# Altium schematic sheet HCPL-3120 Gate Driver Circuit.SchDoc
size A0; SheetNumber: 1; SheetTotal: 1
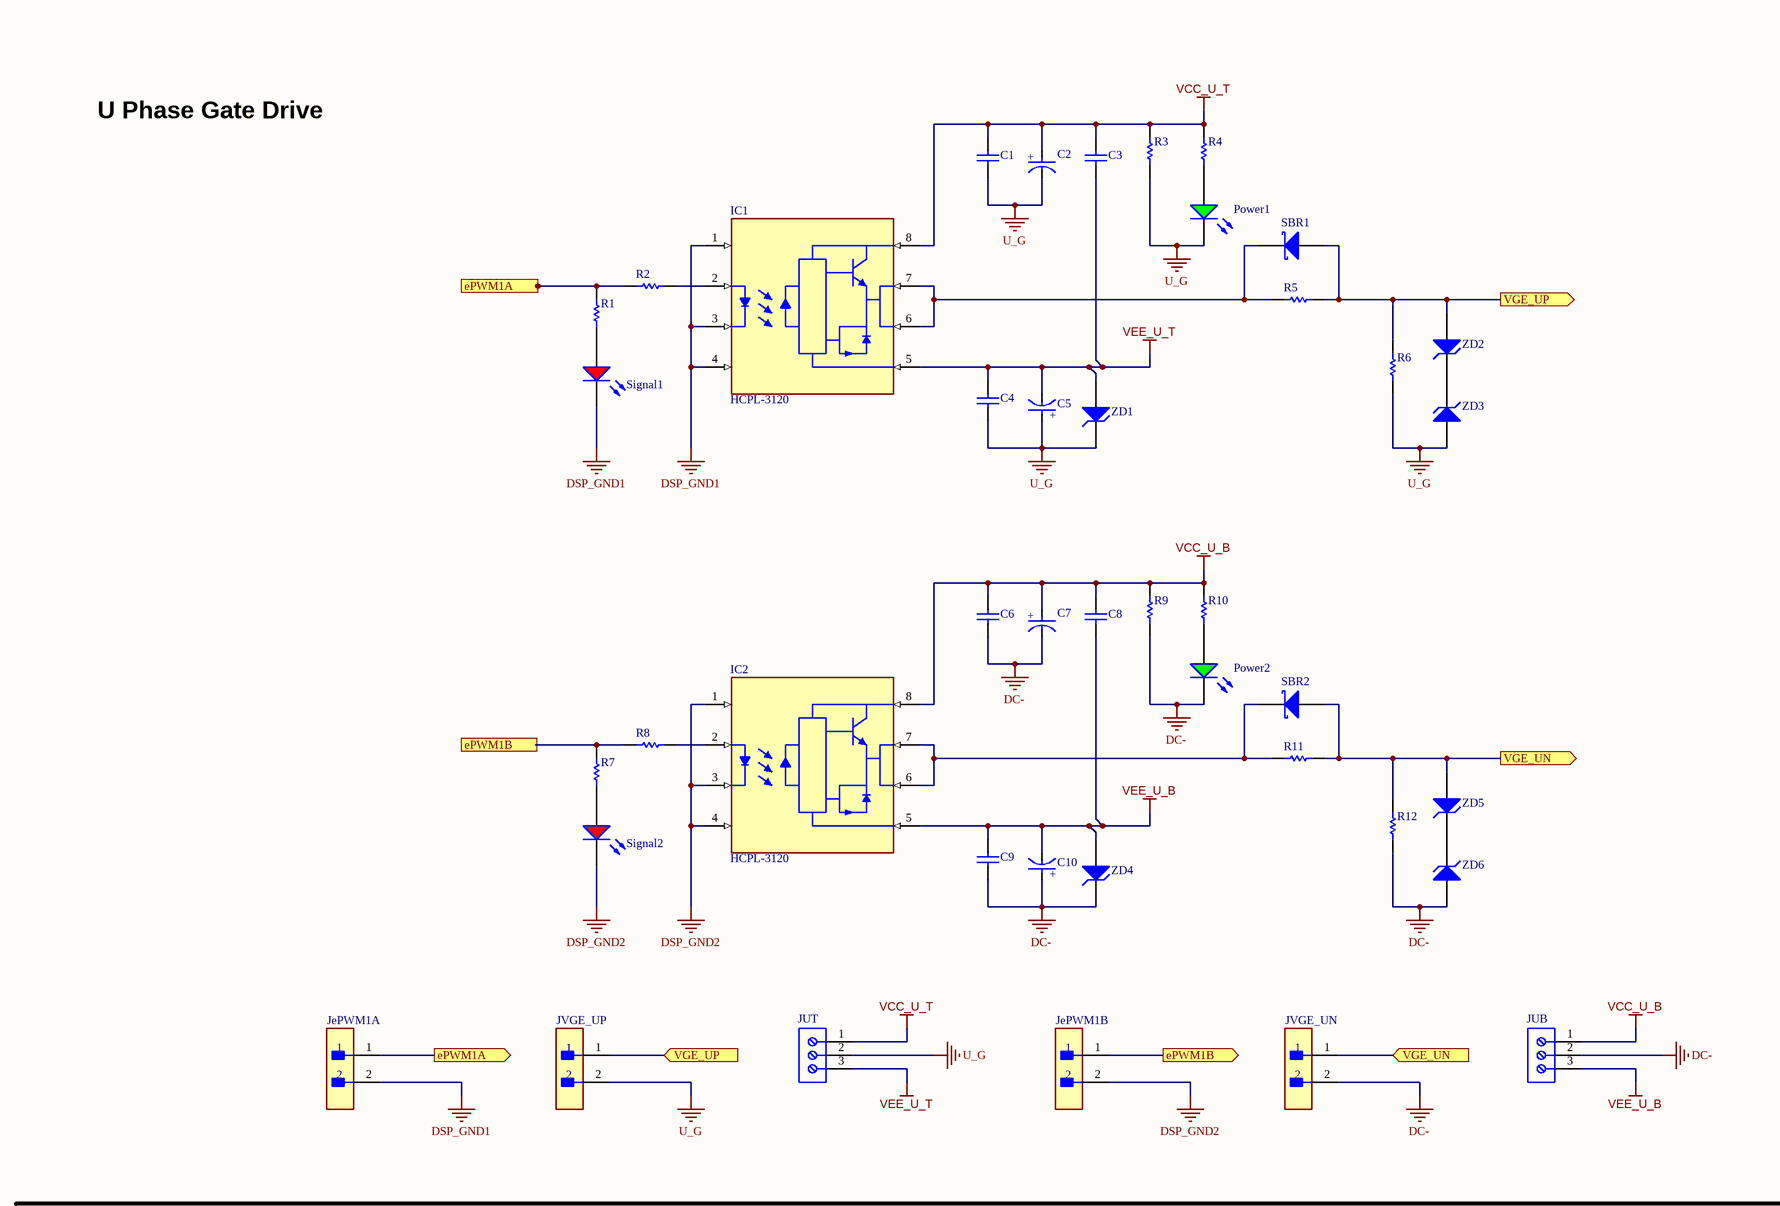
[diagram p0: HCPL-3120 Gate Driver Circuit.SchDoc, left]

## Parts
C1  GRM188R71H104KA93D  [CAPC1608X90X35ML10T15]  (value not drawn)
C2  EEUTA1H101  [FP-RAD-TH-D_10_0_5-L_12_5-MFG]  (value not drawn)
C3  GRM188R71H104KA93D  [CAPC1608X90X35ML10T15]  (value not drawn)
C4  GRM188R71H104KA93D  [CAPC1608X90X35ML10T15]  (value not drawn)
C5  EEUTA1H101  [FP-RAD-TH-D_10_0_5-L_12_5-MFG]  (value not drawn)
C6  GRM188R71H104KA93D  [CAPC1608X90X35ML10T15]  (value not drawn)
C7  EEUTA1H101  [FP-RAD-TH-D_10_0_5-L_12_5-MFG]  (value not drawn)
C8  GRM188R71H104KA93D  [CAPC1608X90X35ML10T15]  (value not drawn)
C9  GRM188R71H104KA93D  [CAPC1608X90X35ML10T15]  (value not drawn)
C10  EEUTA1H101  [FP-RAD-TH-D_10_0_5-L_12_5-MFG]  (value not drawn)
IC1  HCPL-3120  [FP-DIP-8-MFG]
IC2  HCPL-3120  [FP-DIP-8-MFG]
JePWM1A  TSW-102-07-L-S  [FP-TSW-102-07-L-S-MFG]  (value not drawn)
JePWM1B  TSW-102-07-L-S  [FP-TSW-102-07-L-S-MFG]  (value not drawn)
JUB  691214110003  [691214110003]  (value not drawn)
JUT  691214110003  [691214110003]  (value not drawn)
JVGE_UN  TSW-102-07-L-S  [FP-TSW-102-07-L-S-MFG]  (value not drawn)
JVGE_UP  TSW-102-07-L-S  [FP-TSW-102-07-L-S-MFG]  (value not drawn)
Power1  151031VS04000  [WL-TMRC_D3.95H5.3]  (value not drawn)
Power2  151031VS04000  [WL-TMRC_D3.95H5.3]  (value not drawn)
R1  ERJ-8ENF1001V  [RESC3216X70X50LL05T20]  (value not drawn)
R2  ERJ8ENF3300V  [RESC3216X70X50LL05T20]  (value not drawn)
R3  ERJ-8ENF1001V  [RESC3216X70X50LL05T20]  (value not drawn)
R4  ERJ-8ENF1001V  [RESC3216X70X50LL05T20]  (value not drawn)
R5  ERJ-8ENF30R0V  [RESC3216X70X50NL05T20]  (value not drawn)
R6  ERJ-8ENF1002V  [RESC3216X70X50LL05T20]  (value not drawn)
R7  ERJ-8ENF1001V  [RESC3216X70X50LL05T20]  (value not drawn)
R8  ERJ8ENF3300V  [RESC3216X70X50LL05T20]  (value not drawn)
R9  ERJ-8ENF1001V  [RESC3216X70X50LL05T20]  (value not drawn)
R10  ERJ-8ENF1001V  [RESC3216X70X50LL05T20]  (value not drawn)
R11  ERJ-8ENF30R0V  [RESC3216X70X50NL05T20]  (value not drawn)
R12  ERJ-8ENF1002V  [RESC3216X70X50LL05T20]  (value not drawn)
SBR1  DFLS130L-7  [DIOD-POWERDI123-2_A_V]  (value not drawn)
SBR2  DFLS130L-7  [DIOD-POWERDI123-2_A_V]  (value not drawn)
Signal1  151031SS04000  [WL-TMRC_D3.95H5.3]  (value not drawn)
Signal2  151031SS04000  [WL-TMRC_D3.95H5.3]  (value not drawn)
ZD1  MMSZ4688T1G  [ONSC-SOD-123-2-425-04_V]  (value not drawn)
ZD2  SZMMSZ4702T1G  [ONSC-SOD-123-2-425-04_V]  (value not drawn)
ZD3  SZMMSZ4702T1G  [ONSC-SOD-123-2-425-04_V]  (value not drawn)
ZD4  MMSZ4688T1G  [ONSC-SOD-123-2-425-04_V]  (value not drawn)
ZD5  SZMMSZ4702T1G  [ONSC-SOD-123-2-425-04_V]  (value not drawn)
ZD6  SZMMSZ4702T1G  [ONSC-SOD-123-2-425-04_V]  (value not drawn)

## Ports
ePWM1A (in, see HCPL-3120 Gate Driver Circuit[2B]), ePWM1A (out, see HCPL-3120 Gate Driver Circuit[2A]), ePWM1B (in, see HCPL-3120 Gate Driver Circuit[4B]), ePWM1B (out, see HCPL-3120 Gate Driver Circuit[2A]), VGE_UN (in, see HCPL-3120 Gate Driver Circuit[5A]), VGE_UN (out, see HCPL-3120 Gate Driver Circuit[4B]), VGE_UP (in, see HCPL-3120 Gate Driver Circuit[5A]), VGE_UP (out, see HCPL-3120 Gate Driver Circuit[2B])

## Nets
DC-: C6.2 C7.1(C) C9.2 C10.2(A) JUB.2 JVGE_UN.2 Power2.2(K) R9.2 R12.2 ZD4.1(K) ZD6.2(A)
DSP_GND1: IC1.1(N/C) IC1.3(CATHODE) IC1.4(N/C) JePWM1A.2 Signal1.2(K)
DSP_GND2: IC2.1(N/C) IC2.3(CATHODE) IC2.4(N/C) JePWM1B.2 Signal2.2(K)
U_G: C1.2 C2.1(C) C4.2 C5.2(A) JUT.2 JVGE_UP.2 Power1.2(K) R3.2 R6.2 ZD1.1(K) ZD3.2(A)
VCC_U_B: C6.1 C7.2(A) C8.1 IC2.8(VCC) JUB.1 R9.1 R10.1
VCC_U_T: C1.1 C2.2(A) C3.1 IC1.8(VCC) JUT.1 R3.1 R4.1
VEE_U_B: C8.2 C9.1 C10.1(C) IC2.5(VEE) JUB.3 ZD4.2(A)
VEE_U_T: C3.2 C4.1 C5.1(C) IC1.5(VEE) JUT.3 ZD1.2(A)
ePWM1A: JePWM1A.1 R1.1 R2.1 ; port ePWM1A
ePWM1B: JePWM1B.1 R7.1 R8.1 ; port ePWM1B
VGE_UN: JVGE_UN.1 R11.2 R12.1 SBR2.1(A) ZD5.2(A) ; port VGE_UN
VGE_UP: JVGE_UP.1 R5.2 R6.1 SBR1.1(A) ZD2.2(A) ; port VGE_UP
NetIC1_2: IC1.2(ANODE) R2.2
NetIC1_6: IC1.6(VO) IC1.7(VO) R5.1 SBR1.2(K)
NetIC2_2: IC2.2(ANODE) R8.2
NetIC2_6: IC2.6(VO) IC2.7(VO) R11.1 SBR2.2(K)
NetPower1_1: Power1.1(A) R4.2
NetPower2_1: Power2.1(A) R10.2
NetR1_2: R1.2 Signal1.1(A)
NetR7_2: R7.2 Signal2.1(A)
NetZD2_1: ZD2.1(K) ZD3.1(K)
NetZD5_1: ZD5.1(K) ZD6.1(K)

## Notes on the sheet
- U Phase Gate Drive
- (in symbol CMP-05427-000114-1) +

## Library data of the parts
C1 C3 C4 C6 C8 C9 = CMP-2100-03643-1: Chip Capacitor, 0.1 uF, +/- 10%, 50 V, -55 to 125 degC, 0603 (1608 Metric), RoHS, Tape and Reel; Manufacturer: Murata; Dielectric Material: Ceramic; Voltage Rating: 50V; Capacitance: 100nF; Dielectric: X7R; Insulation Resistance: 10GR; Case Code (Metric): 1608; Lead Free: LeadFree; Depth: 0.8mm; Number of Pins: 2; Radiation Hardening: No; Case/Package: 0603; Manufacturer URL: http://www.murata.com/; Packaging: TapeandReel; Length: 1.6mm; Contact Plating: Tin; Datasheet URL: http://psearch.en.murata.com/capacitor/product/GRM188R71H104KA93%23.pdf; Tolerance: 10%; Case Code (Imperial): 0603; Min Operating Temperature: -55degC; RoHSCompliant: true; Voltage: 50V; Termination: SMD/SMT; Mount: SurfaceMount; Material: Ceramic; Package Quantity: 1; Height: 0.8mm; Thickness: 0.035inch; REACH SVHC: NoSVHC; Max Operating Temperature: 125degC; Width: 0.8mm; Package Reference: 0603; Voltage Rating (DC): 50V; Datasheet Version: 42675.0; Package Description: 2-Pin Surface Mount Device, Body 1.6 x 0.8 mm
C2 C5 C7 C10 = CMP-05427-000114-1: Aluminum Electrolytic Capacitors (Radial Lead Type) AEC-Q200 Qualified 100uF ±20% 50V; ESR (Equivalent Series Resistance): 180mR; Lead Diameter: 0.6mm; Life (Hours): 2000Hour; Ripple Current: 555mA; Series: TA; Package Quantity: 200; Length: 12.5mm; Lead Pitch: 5mm; REACH SVHC: No SVHC; RoHS Compliant: Yes; Height: 12.5mm; Contact Plating: Tin; Capacitance: 100uF; Height - Seated (Max): 0.531inch; Min Operating Temperature: -40°C; Voltage Rating (DC): 50V; Voltage Rating: 50V; Case/Package: Radial; Radiation Hardening: No; Tolerance: 20%; Impedance: 180mR; Diameter: 10mm; Packaging: Bulk; Max Operating Temperature: 125°C; Termination: Radial; Mount: Through Hole
IC1 IC2 = HCPL-3120: Optocoupler Drive Push-Pull 1-CH 30V 1500V 8-Pin PDIP Tube
JePWM1A JePWM1B JVGE_UN JVGE_UP = CMP-02766-001428-1: CONN HEADER VERT 2POS 2.54MM; Voltage Rating: 550V; Current Rating: 7.6A; Gender: Male; Number of Contacts: 2; Connector Type: Male Pin; Radiation Hardening: No; Orientation: Straight; Contact Plating: Gold; Max Operating Temperature: 125°C; Mount: Through Hole; Package Quantity: 1; Number of Rows: 1; Housing Material: Polyester; RoHS Compliant: Yes; Length: 5.08mm; Max Voltage Rating (AC): 550V; Pitch: 2.54mm; Packaging: Bulk; Depth: 2.54mm; Termination: Solder; Min Operating Temperature: -55°C; Housing Color: Black; Lead Free: Lead Free; Color: Black; Number of Positions: 2; Width: 2.54mm; Max Current Rating: 7.6A; REACH SVHC: No SVHC; Contact Material: Bronze; Contact Mating Length: 0.23inch; Series: TSW; Contact Type: Male Pin
JUB JUT = CMP-1502-02466-2: NexarPartId: 18818289; Number of Levels: 1; Voltage: 300V; Pitch: 3.5052mm; Stripping Length: -6mm; Number of Positions Per Level: 3; Plating: Brass, Steel; Wire/Cable Gauge: 24AWG; Wire Gauge (Min): 16AWG; Current Rating: 10A; Width: 10.9mm; Length: 7.4mm; Housing Material: Nylon; Height: 12.2mm; Min Operating Temperature: -40°C; Contact Plating: Brass, Tin; Packaging: Box; Color: Blue, Green; Number of Contacts: 3; Number of Pins: 3; Voltage Rating: 300V; Termination: Screw; Lead Pitch: 3.5mm; Max Operating Temperature: 105°C; Mount: Through Hole; Contact Material: Brass; RoHS: Compliant; Wire Gauge (Max): 24AWG; Current: 10A; REACH SVHC: Unknown
Power1 Power2 = CMP-1488-00001-2: Led, Green, T-1 (3Mm), 570 Nm, 2.1 V, 30 Ma, 120 Mcd; NexarPartId: 29717804; Test Current: 20mA; Peak Wavelength: 573nm; Max Reverse Voltage (DC): 5V; Forward Voltage: 2.1V; Forward Current: 100mA; Dominant Wavelength: 570nm; Lens Style: Circular, Diffused, Round; Viewing Angle: 40°; Luminous Intensity: 120mcd; REACH SVHC: Unknown; Lens Size: 3mm; Mount: Through Hole; Width: 3mm; Color: Green; Case/Package: Radial; Packaging: Bulk; Height: 5.3mm; Wavelength: 570nm; RoHS: Compliant; Max Operating Temperature: 85°C; Length: 3mm; Number of Pins: 2; Min Operating Temperature: -40°C
R1 R3 R4 R7 R9 R10 = CMP-2003-00017-1: Res Thick Film 1206 1K Ohm 1% 0.25W(1/4W) ±100ppm/C Pad SMD Automotive T/R; Manufacturer: Panasonic; Part Number: ERJ-8ENF1001V
R2 R8 = CMP-2003-00307-1: Res Thick Film 1206 330 Ohm 1% 0.25W ±100ppm/°C Molded SMD Punched Carrier T/R; Manufacturer: Panasonic; Part Number: ERJ8ENF3300V
R5 R11 = CMP-2003-00294-1: Res Thick Film 1206 30 Ohm 1% 0.25W ±100ppm/°C Molded SMD Punched Carrier T/R; Manufacturer: Panasonic; Part Number: ERJ-8ENF30R0V
R6 R12 = CMP-2003-00018-1: Res Thick Film 1206 10K Ohm 1% 0.25W(1/4W) ±100ppm/C Pad SMD Automotive T/R; Manufacturer: Panasonic; Part Number: ERJ-8ENF1002V
SBR1 SBR2 = CMP-2000-07448-1: Schottky Barrier Rectifier, 30 V, 1 A, -40 to 125 degC, 2-Pin SMD, RoHS, Tape and Reel; Manufacturer: Diodes Inc; Max Repetitive Reverse Voltage (Vrrm): 30V; Polarity: Standard; Average Rectified Current: 1A; Element Configuration: Single; Forward Voltage: 360mV; Peak Non-Repetitive Surge Current: 50A; Max Power Dissipation: 1.67W; Case\/Package: SMD/SMT; Capacitance: 76pF; Peak Reverse Current: 1mA; Datasheet URL: https://www.diodes.com/assets/Datasheets/ds30492.pdf; Package Quantity: 3000; Reverse Voltage (DC): 30V; Package Reference: POWERDI123-2_A; Lead Free: LeadFree; Mounting Technology: SurfaceMount; Max Operating Temperature: 125degC; Current Rating: 1A; Radiation Hardening: No; Width: 1.78mm; Height: 0.98mm; Output Current: 1A; Contact Plating: Matte; Length: 2.8mm; Number of Pins: 2; Voltage Rating (DC): 30V; RoHSCompliant: true; Termination: SMD/SMT; Forward Current: 1A; Min Operating Temperature: -40degC; Datasheet Version: Rev. 4-2, 06/2009; Packaging: TapeandReel; REACH SVHC: NoSVHC; Max Forward Surge Current (Ifsm): 50A; Manufacturer URL: http://www.diodes.com/; Mount: SurfaceMount; Package Description: 2-Pin Small Outline Diode, Body 2.8 x 1.78 mm
Signal1 Signal2 = CMP-1488-00005-2: Led, Red, T-1 (3Mm), 635 Nm, 2 V, 30 Ma, 160 Mcd; NexarPartId: 29717802; Wavelength: 635nm; Luminous Intensity: 160mcd; Peak Wavelength: 640nm; Forward Voltage: 2V; Max Reverse Voltage (DC): 5V; Viewing Angle: 40°; Forward Current: 100mA; Lens Style: Circular, Diffused, Round; Test Current: 20mA; Packaging: Bulk; Lens Size: 3mm; RoHS: Compliant; Height: 5.3mm; Mount: Through Hole; Max Operating Temperature: 85°C; Color: Red; Length: 3mm; Dominant Wavelength: 635nm; REACH SVHC: Unknown; Case/Package: Radial; Min Operating Temperature: -40°C; Width: 3mm
ZD1 ZD4 = CMP-1060-00561-1: Zener Voltage Regulator, 500 mW, 2-Pin SOD-123, Pb-Free, Tape and Reel; Manufacturer: On Semiconductor; VZ Typ (V): 4.7; P Max (W): 0.5; PackageDescription: 2-Pin SOD, Body 1.6 x 2.69 mm; PackageReference: SOD-123-2-425-04; ComponentLink3Description: Package Specification; PartNumber: MMSZ4688T1G; Packing: Tape and Reel; ComponentLink2Description: Datasheet; DatasheetVersion: Rev. 9; PackageVersion: Rev. G, 10/2009; Mounting Technology: Surface Mount; ComponentLink2URL: http://www.onsemi.com/pub_link/Collateral/MMSZ4678T1-D.PDF; ComponentLink3URL: http://www.onsemi.com/pub_link/Collateral/425-04.PDF; RoHS: Pb-Free; ComponentLink1URL: http://www.onsemi.com/; ComponentLink1Description: Manufacturer URL
ZD2 ZD3 ZD5 ZD6 = CMP-1060-00300-1: Zener Voltage Regulator, 500 mW, 2-Pin SOD-123, Pb-Free, Tape and Reel; Manufacturer: On Semiconductor; VZ Typ (V): 15; P Max (W): 0.5; PackageDescription: 2-Pin SOD, Body 1.6 x 2.69 mm; DatasheetVersion: Rev. 9; Packing: Tape and Reel; ComponentLink2URL: http://www.onsemi.com/pub_link/Collateral/MMSZ4678T1-D.PDF; ComponentLink3URL: http://www.onsemi.com/pub_link/Collateral/425-04.PDF; ComponentLink1Description: Manufacturer URL; ComponentLink1URL: http://www.onsemi.com/; RoHS: Pb-Free; Mounting Technology: Surface Mount; ComponentLink2Description: Datasheet; PackageVersion: Rev. G, 10/2009; PackageReference: SOD-123-2-425-04; PartNumber: SZMMSZ4702T1G; ComponentLink3Description: Package Specification